# Altium schematic sheet RemoteSensors.SchDoc
size A4; Author: Ben Bowden, Jesse Mocilac, Tayla Bender, Rothon Browne; CompanyName: James Cook University; DrawnBy1: Ben Bowden, Jesse Mocilac, Tayla Bender, Rothon Browne; Organization: James Cook University; Title1: CC3501 Baby Monitor; SheetNumber: 3; SheetTotal: 4; ProjectName: *ProjectName
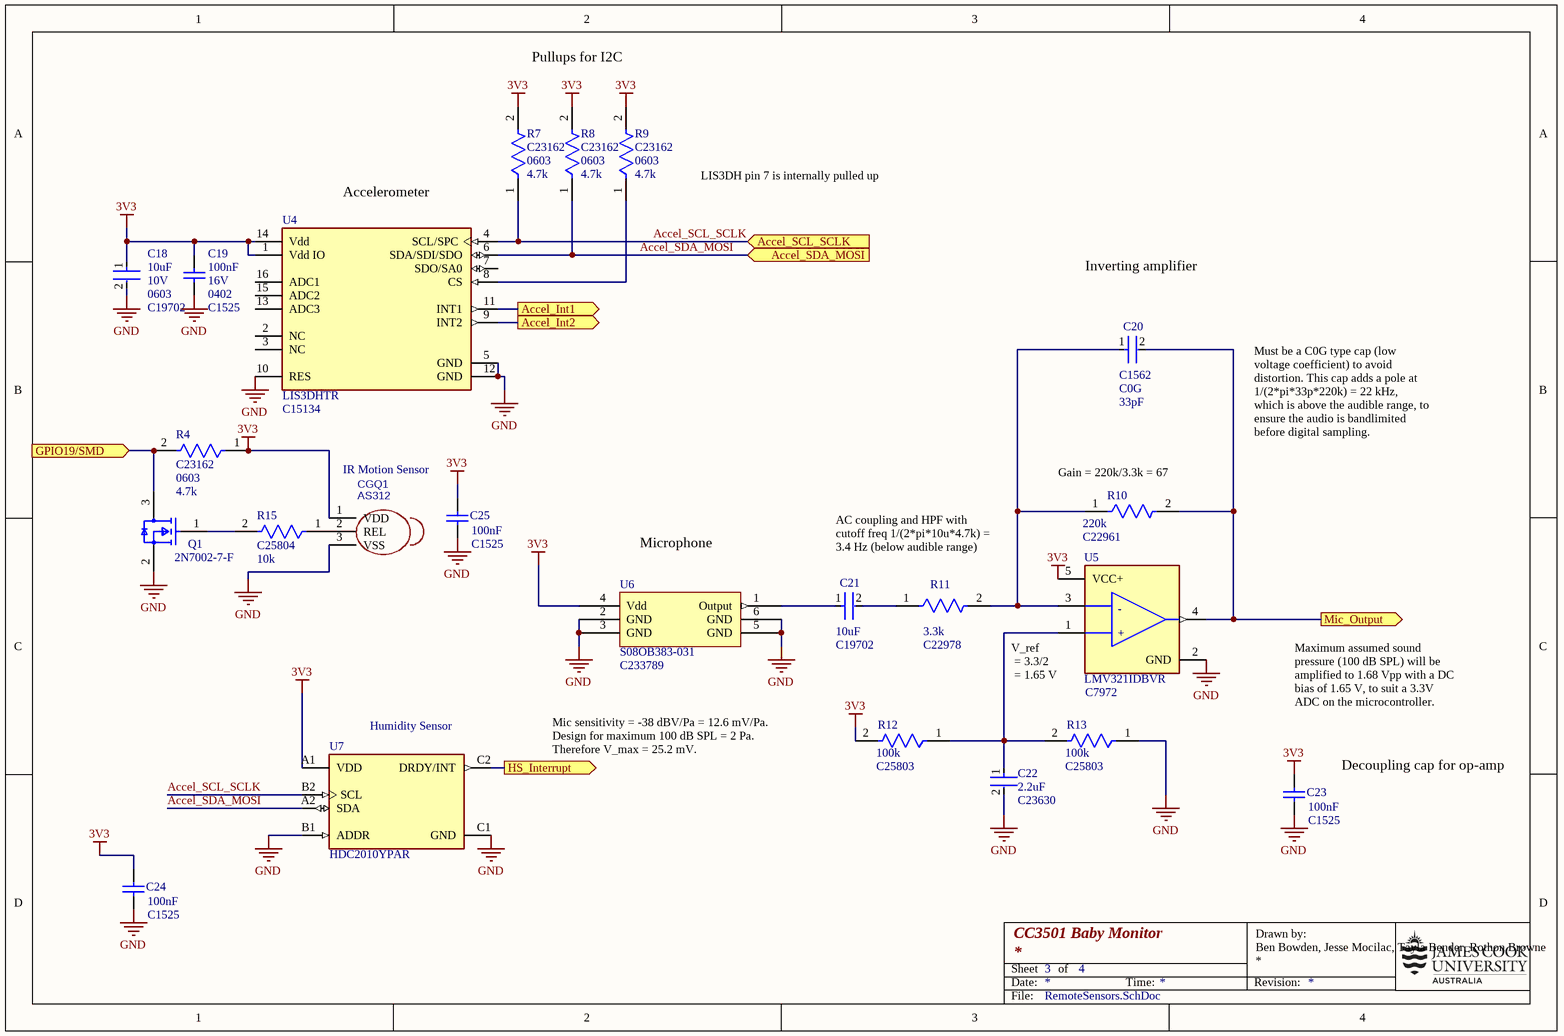
[diagram p0: RemoteSensors.SchDoc]

## Parts
C18  Voltage Rating: 10V  Case Code (Imperial): 0603  JLCPCB Part: C19702  Capacitance: 10uF  [FP-CL10-IPC_B]  (hidden comment: CL10A106KP8NNNC)
C19  JLCPCB Part: C1525  Case Size/Dimension: 0402  Capacitance: 100nF  Rated Voltage: 16V  [CAPC1050X55X23ML05T13]  (hidden comment: CL05B104KO5NNNC)
C20  Capacitance: 33pF  Dielectric: C0G  JLCPCB Part: C1562  [FP-0402-L_1_0_1-W_0_5_0_1-IPC_A]  (hidden comment: 0402CG330J500NT)
C21  JLCPCB Part: C19702  Capacitance: 10uF  [FP-CL10-IPC_B]  (hidden comment: CL10A106KP8NNNC)
C22  Capacitance: 2.2uF  JLCPCB Part: C23630  [FP-CL10-IPC_B]  (hidden comment: CL10A225KO8NNNC)
C23  JLCPCB Part: C1525  Capacitance: 100nF  [CAPC1050X55X23ML05T13]  (hidden comment: CL05B104KO5NNNC)
C24  JLCPCB Part: C1525  Capacitance: 100nF  [CAPC1050X55X23ML05T13]  (hidden comment: CL05B104KO5NNNC)
C25  JLCPCB Part: C1525  Capacitance: 100nF  [CAPC1050X55X23ML05T13]  (hidden comment: CL05B104KO5NNNC)
CGQ1  AS312  [SENSORM-TH_3P_AS312]
Q1  2N7002-7-F  [FP-SOT23-MFG]
R4  JLCPCB Part: C23162  Case/Package: 0603  Resistance: 4.7k  [FP-CRCW0603-e3-IPC_B]  (hidden comment: 0603WAF4701T5E)
R7  JLCPCB Part: C23162  Case/Package: 0603  Resistance: 4.7k  [FP-CRCW0603-e3-IPC_B]  (hidden comment: 0603WAF4701T5E)
R8  JLCPCB Part: C23162  Case/Package: 0603  Resistance: 4.7k  [FP-CRCW0603-e3-IPC_B]  (hidden comment: 0603WAF4701T5E)
R9  JLCPCB Part: C23162  Case/Package: 0603  Resistance: 4.7k  [FP-CRCW0603-e3-IPC_B]  (hidden comment: 0603WAF4701T5E)
R10  Resistance: 220k  JLCPCB Part: C22961  [FP-CRCW0603-e3-IPC_B]  (hidden comment: 0603WAF2203T5E)
R11  JLCPCB Part: C22978  Resistance: 3.3k  [FP-CRCW0603-e3-IPC_B]  (hidden comment: 0603WAF3301T5E)
R12  JLCPCB Part: C25803  Resistance: 100k  [FP-CRCW0603-e3-IPC_B]  (hidden comment: 0603WAF1003T5E)
R13  JLCPCB Part: C25803  Resistance: 100k  [FP-CRCW0603-e3-IPC_B]  (hidden comment: 0603WAF1003T5E)
R15  JLCPCB Part: C25804  Resistance: 10k  [FP-CRCW0603-e3-IPC_B]  (hidden comment: 0603WAF1002T5E)
U4  LIS3DHTR  JLCPCB Part: C15134  [FP-LGA-16-7983231-MFG]
U5  LMV321IDBVR  JLCPCB Part: C7972  [FP-DBV0005A-IPC_B]
U6  S08OB383-031  JLCPCB Part: C233789  [Goertek_S08OB381-026]
U7  HDC2010YPAR  [FP-YPA0006-MFG]

## Ports
Accel_Int1 (out), Accel_Int2 (out), Accel_SCL_SCLK (in), Accel_SDA_MOSI (in), GPIO19/SMD (in), HS_Interrupt (out), Mic_Output (out)

## Nets
3V3: C18.1 C19.2 C23.2 C24.2 C25.2 CGQ1.1(VDD) R4.1 R7.2 R8.2 R9.2 R12.2 U4.1(Vdd_IO) U4.14(Vdd) U5.5(VCC+) U6.4(Vdd) U7.A1(VDD)
GND: C18.2 C19.1 C22.2 C23.1 C24.1 C25.1 CGQ1.3(VSS) Q1.2(S) R13.1 U4.5(GND) U4.10(RES) U4.12(GND) U5.2(GND) U6.2(GND) U6.3(GND) U6.5(GND) U6.6(GND) U7.B1(ADDR) U7.C1(GND)
Accel_Int1: U4.11(INT1) ; port Accel_Int1
Accel_Int2: U4.9(INT2) ; port Accel_Int2
Accel_SCL_SCLK: R7.1 U4.4(SCL/SPC) U7.B2(SCL) ; port Accel_SCL_SCLK
Accel_SDA_MOSI: R8.1 U4.6(SDA/SDI/SDO) U7.A2(SDA) ; port Accel_SDA_MOSI
GPIO19/SMD: Q1.3(D) R4.2 ; port GPIO19/SMD
HS_Interrupt: U7.C2(DRDY/INT) ; port HS_Interrupt
Mic_Output: C20.2 R10.2 U5.4(OUT) ; port Mic_Output
NetC20_1: C20.1 R10.1 R11.2 U5.3(1IN-)
NetC21_1: C21.1 U6.1(Output)
NetC21_2: C21.2 R11.1
NetC22_1: C22.1 R12.1 R13.2 U5.1(1IN+)
NetCGQ1_2: CGQ1.2(REL) R15.1
NetQ1_1: Q1.1(G) R15.2
NetR9_1: R9.1 U4.8(CS)

Not connected (* = marked no-connect by the designer): U4 2(NC) 3(NC) 7(SDO/SA0) 13(ADC3) 15(ADC2) 16(ADC1)

## Notes on the sheet
- Pullups for I2C
- (near U4) Accelerometer
- LIS3DH pin 7 is internally pulled up
- Inverting amplifier
- IR Motion Sensor
- (near R10) Gain = 220k/3.3k = 67
- Must be a C0G type cap (low voltage coefficient) to avoid distortion. This cap adds a pole at 1/(2*pi*33p*220k) = 22 kHz, which is above the audible range, to ensure the audio is bandlimited before digital sampling.
- Microphone
- AC coupling and HPF with cutoff freq 1/(2*pi*10u*4.7k) = 3.4 Hz (below audible range)
- (near U5) V_ref
  = 3.3/2
  = 1.65 V
- Maximum assumed sound pressure (100 dB SPL) will be amplified to 1.68 Vpp with a DC bias of 1.65 V, to suit a 3.3V ADC on the microcontroller.
- (near U7) Humidity Sensor
- Mic sensitivity = -38 dBV/Pa = 12.6 mV/Pa.
  Design for maximum 100 dB SPL = 2 Pa.
  Therefore V_max = 25.2 mV.
- (near C23) Decoupling cap for op-amp
- Date:
- Sheet
- of
- Time:
- Revision:
- Drawn by:
- File:
- (in symbol CMP-00012-2) +

## Library data of the parts
C18 C21 = CMP-00006-4: Cap Ceramic 10uF 10V X5R ±10% Pad SMD 0603 +85°C T/R; Max Operating Temperature: 85°C; Tolerance: 10%; Case/Package: 0603; Mount: Surface Mount; Packaging: Tape and Reel; Width: 0.031inch; Thickness: 0.041inch; Length: 0.063inch; Case Code (Metric): 1608; Min Operating Temperature: -55°C
  C21: Voltage Rating: 10V; Case Code (Imperial): 0603
C19 = CMP-00007-3: Chip Capacitor, 100 nF, +/- 10%, 16 V, -55 to 125 degC, 0402 (1005 Metric), RoHS, Tape and Reel; Manufacturer: Samsung Electro-Mechanics; Dielectric: X7R; Manufacturer URL: http://www.samsungsem.com/global/index.jsp; Tolerance (%): ±10%; Datasheet Version: Nov-10; Datasheet URL: https://datasheet.ciiva.com/29198/458718-da-01-en-vs-kondensator-0402-29198423.pdf
C20 = CMP-00008-5: General Purpose Ceramic Capacitor, 0402, 33pF, 5%, C0G, 30ppm/°C, 50V; Insulation Resistance: 100GR; RoHS Compliant: Yes; Case Code (Metric): 1005; Voltage Rating (DC): 50V; REACH SVHC: No SVHC; Packaging: Tape and Reel; Length: 1mm; Radiation Hardening: No; Mount: Surface Mount; Depth: 0.5mm; Width: 0.5mm; Series: -; Thickness: 0.022inch; Contact Plating: Tin; Voltage Rating: 50V; Case/Package: 0402; Construction: Flat; Max Operating Temperature: 125°C; Lead Free: Lead Free; Voltage: 50V; Termination: SMD/SMT; Height: 0.5mm; Case Code (Imperial): 0402; Temperature Coefficient: 30ppm/°C; Number of Pins: 2; Min Operating Temperature: -55°C; Package Quantity: 1; Tolerance: 5%
C22 = CMP-006-0001-1: Cap Ceramic 2.2uF 16V X5R ±20% Pad SMD 0603 +85°C T/R; Tolerance: 10%; Case Code (Metric): 1608; Thickness: 0.035inch; Case Code (Imperial): 0603; Width: 0.031inch; Voltage Rating: 16V; Min Operating Temperature: -55°C; Case/Package: 0603; Max Operating Temperature: 85°C; Length: 1.6mm; Packaging: Tape and Reel; Mount: Surface Mount
C23-C25 = CMP-00007-3: Chip Capacitor, 100 nF, +/- 10%, 16 V, -55 to 125 degC, 0402 (1005 Metric), RoHS, Tape and Reel; Manufacturer: Samsung Electro-Mechanics; Dielectric: X7R; Rated Voltage: 16V; Manufacturer URL: http://www.samsungsem.com/global/index.jsp; Case Size/Dimension: 0402; Tolerance (%): ±10%; Datasheet Version: Nov-10; Datasheet URL: https://datasheet.ciiva.com/29198/458718-da-01-en-vs-kondensator-0402-29198423.pdf
CGQ1 = AS312: Manufacturer: 森霸; Supplier: LCSC; Manufacturer Part: AS312; Supplier Part: C90465; JLCPCB Part Class: Extended Part; spicePre: C; spiceSymbolName: AS312
Q1 = CMP-2000-04929-2: MOSFET N-CH 60V 115MA SOT23-3; Turn-On Delay Time: 7ns; Turn-Off Delay Time: 11ns; Drain to Source Resistance: 7.5R; Rise Time: 3ns; Drain to Source Breakdown Voltage: 70V; Input Capacitance: 50pF; Number of Elements: 1; Power Dissipation: 540mW; Max Power Dissipation: 300mW; Fall Time: 5.6ns; Gate to Source Voltage (Vgs): 20V; Threshold Voltage: 2.5V; Element Configuration: Single; Termination: SMD/SMT; Weight: 0.000282oz; Radiation Hardening: No; Max Operating Temperature: 150°C; On-State Resistance: 7.5R; Mount: Surface Mount; Current Rating: 115mA; Contact Plating: Tin; Lead Free: Lead Free; Min Operating Temperature: -55°C; Number of Pins: 3; REACH SVHC: No SVHC; Drain to Source Voltage (Vdss): 60V; Width: 1.3mm; Package Quantity: 3000; Length: 2.9mm; Case/Package: SOT-23; Number of Channels: 1; Dual Supply Voltage: 60V; Packaging: Tape and Reel; Height: 1mm; Voltage Rating (DC): 60V; Nominal Vgs: 2.5V; Continuous Drain Current (ID): 115mA; Voltage: 60V; Rds On Max: 7.5R
R4 R7-R9 = CMP-009-0001-3: RES Thick Film, 4.7kΩ, 1%, 0.1W, 100ppm/°C, 0603; Voltage Rating (DC): 75V; Power Rating: 100mW; Mount: Surface Mount; Width: 0.85mm; Weight: 7.1E-05oz; Case Code (Imperial): 0603; Radiation Hardening: No; Min Operating Temperature: -55°C; Composition: Thick Film; Temperature Coefficient: 100ppm/°C; Voltage Rating: 75V; Length: 1.55mm; Height: 0.45mm; Termination: SMD/SMT; Max Operating Temperature: 155°C; Military Standard: Not; Packaging: Tape and Reel; Contact Plating: Tin; Lead Free: Lead Free; Package Quantity: 5000; Number of Pins: 2; Depth: 0.85mm; Tolerance: 1%; Case Code (Metric): 1608
R10 = CMP-009-0005-2: RES Thick Film, 220kΩ, 1%, 0.1W, 100ppm/°C, 0603; Voltage Rating: 75V; Power Rating: 100mW; Packaging: Tape and Reel; Width: 0.85mm; Military Standard: Not; Package Quantity: 5000; Depth: 0.85mm; Lead Free: Lead Free; Min Operating Temperature: -55°C; Case Code (Imperial): 0603; Max Operating Temperature: 155°C; Height: 0.45mm; Mount: Surface Mount; Temperature Coefficient: 100ppm/°C; Radiation Hardening: No; Termination: SMD/SMT; Contact Plating: Tin; Length: 1.55mm; Voltage Rating (DC): 75V; Composition: Thick Film; Case Code (Metric): 1608; Tolerance: 1%; Number of Pins: 2; Case/Package: 0603; Weight: 7.1E-05oz
R11 = CMP-009-0006-1: RES Thick Film, 3.3kΩ, 1%, 0.1W, 100ppm/°C, 0603; Voltage Rating (DC): 75V; Power Rating: 100mW; Case Code (Metric): 1608; Case/Package: 0603; Termination: SMD/SMT; Weight: 7.1E-05oz; Tolerance: 1%; Width: 0.85mm; Temperature Coefficient: 100ppm/°C; Length: 1.55mm; Max Operating Temperature: 155°C; Lead Free: Lead Free; Package Quantity: 5000; Voltage Rating: 75V; Military Standard: Not; Height: 0.45mm; Case Code (Imperial): 0603; Min Operating Temperature: -55°C; Packaging: Tape and Reel; Contact Plating: Tin; Radiation Hardening: No; Number of Pins: 2; Mount: Surface Mount; Depth: 0.85mm; Composition: Thick Film
R12 R13 = CMP-009-0004-3: RES Thick Film, 100kΩ, 1%, 0.1W, 100ppm/°C, 0603; Power Rating: 100mW; Voltage Rating: 75V; Mount: Surface Mount; Number of Pins: 2; Depth: 0.85mm; Case/Package: 0603; Composition: Thick Film; Max Operating Temperature: 155°C; Case Code (Metric): 1608; Contact Plating: Tin; Temperature Coefficient: 100ppm/°C; Weight: 7.1E-05oz; Height: 0.45mm; Termination: SMD/SMT; Tolerance: 1%; Min Operating Temperature: -55°C; Lead Free: Lead Free; Voltage Rating (DC): 75V; Case Code (Imperial): 0603; Length: 1.55mm; Packaging: Tape and Reel; Package Quantity: 5000; Radiation Hardening: No; Width: 0.85mm; Military Standard: Not
R15 = CMP-009-0009-1: RES Thick Film, 10kΩ, 1%, 0.1W, 100ppm/°C, 0603; Voltage Rating: 75V; Power Rating: 100mW; Composition: Thick Film; Military Standard: Not; Temperature Coefficient: 100ppm/°C; Length: 1.55mm; Tolerance: 1%; Lead Free: Lead Free; Max Operating Temperature: 155°C; Number of Pins: 2; Width: 0.85mm; Termination: SMD/SMT; Packaging: Tape and Reel; Weight: 7.1E-05oz; Radiation Hardening: No; Voltage Rating (DC): 75V; Height: 0.45mm; Min Operating Temperature: -55°C; Mount: Surface Mount; Contact Plating: Tin; Case Code (Metric): 1608; Case Code (Imperial): 0603; Depth: 0.85mm; Case/Package: 0603; Package Quantity: 5000
U4 = CMP-00010-2: ACCEL 2-16G I2C/SPI 16LGA; Interface: I2C; Max Supply Voltage: 3.6V; Axis: X, Y, Z; Operating Supply Voltage: 2.5V; Bandwidth: 5kHz; Resolution: 16b; Operating Supply Current: 11uA; Sensor Type: 3 Axis; Min Supply Voltage: 1.71V; Output Type: Digital; Series: -; Number of Pins: 16; Radiation Hardening: No; Package Quantity: 1; Case/Package: LGA; Contact Plating: Gold; Min Operating Temperature: -40°C; REACH SVHC: No SVHC; RoHS Compliant: Yes; Lead Free: Lead Free; Min Supply Voltage (DC): 1.71V; Length: 3mm; Height: 1mm; Max Supply Voltage (DC): 3.6V; Width: 3mm; Max Operating Temperature: 85°C; Depth: 3mm; Packaging: Tape and Reel
U5 = CMP-00012-2: General Purpose Amplifier 1 Circuit Rail-to-Rail SOT-23-5; Slew Rate: 1V/µs; Max Supply Voltage: 5.5V; Input Offset Voltage (Vos): 7mV; Common Mode Rejection Ratio: 50dB; Number of Channels: 1; Supply Current: 250uA; Min Supply Voltage: 2.7V; Input Bias Current: 250nA; Output Current per Channel: 160mA; Operating Supply Current: 130uA; Gain Bandwidth Product: 1MHz; Voltage Gain: 100dB; REACH SVHC: No SVHC; RoHS Compliant: Yes; Max Operating Temperature: 125°C; Number of Pins: 5; Min Operating Temperature: -40°C; Case/Package: SOT-23-5; Packaging: Tape and Reel; Mount: Surface Mount; Technology: BICMOS; Number of Elements: 1; Nominal Supply Current: 250uA; Number of Circuits: 1; Output Current: 160mA; Series: -; Package Quantity: 1; Unity Gain Bandwidth Product: 1MHz; Power Supply Rejection Ratio (PSRR): 50dB; Contact Plating: Tin,Matte; Lead Free: Lead Free; Radiation Hardening: No; Bandwidth: 1MHz; Number of Amplifiers: 1; Amplifier Type: GENERAL PURPOSE
U6 = CMP-00000-2: MEMS Microphone SMD 3.76x3x1.1mm
U7 = CMP-04948-000007-1: GEN 2 HUMIDITY SENSOR; Manufacturer: Texas Instruments; Resolution: 14bits; Sensor Output: I2C; Operating Supply Current: 0.105-650uA; Accuracy: 2%; Min Supply Voltage: 1.62V; Max Supply Voltage: 3.6V; Standoff Height: 0.215mm; Digikey Description: GEN 2 HUMIDITY SENSOR; ComponentLink2URL: http://www.ti.com/lit/ds/symlink/hdc2010.pdf; ComponentLink2Description: Datasheet; RoHS: TRUE; Category: IC; Automotive: No; Ipc Land Pattern Name: BGA6N50P2X3_146X146X67; Device Class L1: Sensors; Height: 0.675mm; Mouser Description: Low Power Humidity and Temperature Digital Sensor 6-DSBGA -40 to 85; Package: YPA0006; Manufacturer Part Number: HDC2010YPAR; Temperature: -40°C to +85°C; Device Class L3: unset; Temperature Range High: +85°C; Lead Free: Yes; Interface: I2C; Device Class L2: Temperature and Humidity Sensors; Temperature Range Low: -40°C; Octopart: https://octopart.com/hdc2010ypar-texas+instruments-84791680